# Altium schematic sheet MicroUSB.SchDoc
size A4
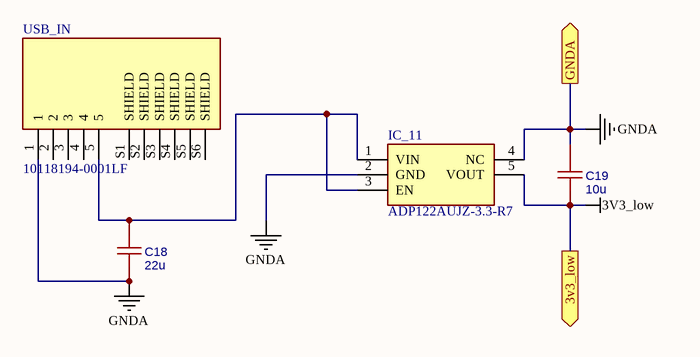
[diagram p0: MicroUSB.SchDoc]

## Parts
C18  22u  [CAPC3216X190]
C19  10u  [CAPC3216X190]
IC_11  ADP122AUJZ-3.3-R7  [SOT95P280X100-5N]
USB_IN  10118194-0001LF  [AMPHENOL_10118194-0001LF]

## Ports
3v3_low (out), GNDA (out)

## Nets
3V3_low: C19.1 IC_11.5(VOUT) ; port 3v3_low
GNDA: C18.1 C19.2 IC_11.2(GND) IC_11.4(NC) USB_IN.1 ; port GNDA
NetC18_2: C18.2 IC_11.1(VIN) IC_11.3(EN) USB_IN.5

Not connected (* = marked no-connect by the designer): USB_IN 2 3 4 S1(SHIELD) S2(SHIELD) S3(SHIELD) S4(SHIELD) S5(SHIELD) S6(SHIELD)

## Library data of the parts
C18 C19 = 100nF: nameAlias: Value(F); spicePre: C; spiceSymbolName: Cap_RAD-0.1_US
IC_11 = ADP122AUJZ-3.3-R7: Integrated Circuit; Manufacturer_Name: Analog Devices; Datasheet Link: http://uk.rs-online.com/web/p/products/9128071; Height: 1mm; Manufacturer_Part_Number: ADP122AUJZ-3.3-R7; Arrow Part Number: ADP122AUJZ-3.3-R7; Arrow Price/Stock: https://www.arrow.com/en/products/adp122aujz-3.3-r7/analog-devices; Mouser Part Number: 584-ADP122AUJZ-3.3R7; Mouser Price/Stock: https://www.mouser.co.uk/ProductDetail/Analog-Devices/ADP122AUJZ-33-R7?qs=BpaRKvA4VqERsawSFjb%252Blw%3D%3D
USB_IN = 10118194-0001LF: USB - micro B USB 2.0 Receptacle Connector 5 Position Surface Mount, Right Angle; Through Hole; MF: Amphenol ICC; Package: None; Price: None; Availability: Unavailable; MP: 10118194-0001LF; SnapEDA_Link: https://www.snapeda.com/parts/10118194-0001LF/Amphenol%20FCI/view-part/1413308/?ref=snap; Value: *